# EAGLE design Eagle_TiltSwitch (EAGLE 7.2.0)
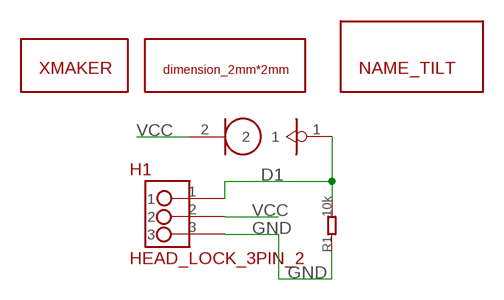
[diagram p0: schematic, sheet 1]

## Parts
H1  HEAD_LOCK_3PIN_2  [HEAD_LOCK_3PIN_2]
J1  TILT  [TILT]
R1  10k  005-R0603  [0603]
U$2  XMAKERLOGO  [XMAKERLOGO]
U$3  DIMENSION_2MM2MM  [DIMENSION_2MM*2MM]
U$4  NAME_LILT  [NAME_TILT]

## Nets
D1: H1.1 J1.1 R1.2
GND: H1.3 R1.1
VCC: H1.2 J1.2

## Library data of the parts
H1 = Xmaker:HEAD_LOCK_3PIN_2
J1 = Seeed:TILT
R1 = Discrete:005-R*
U$2 = Xmaker_yuhui:XMAKERLOGO
U$3 = Xmaker:DIMENSION_2MM*2MM
U$4 = Xmaker:NAME_LILT

## Board
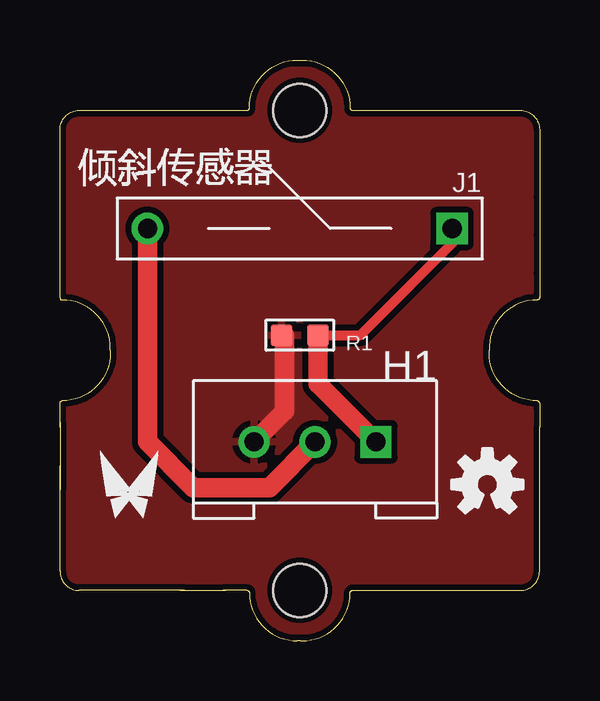
[diagram p1: board, top side]
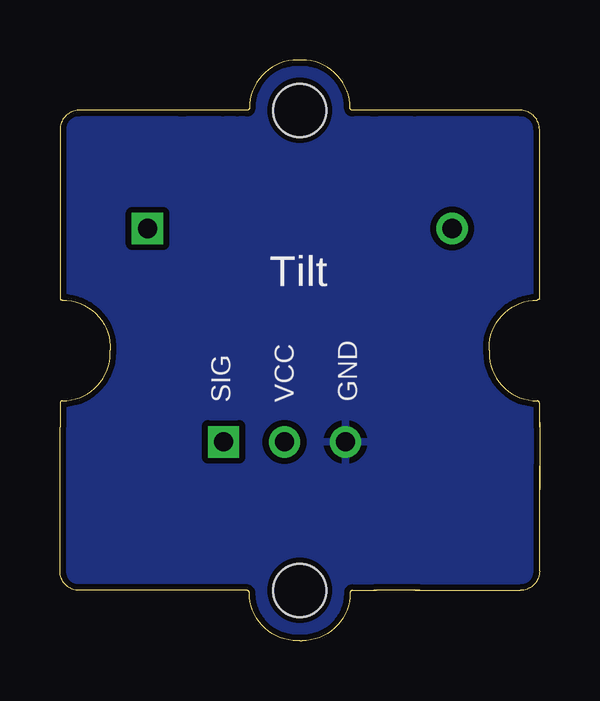
[diagram p2: board, bottom side, seen from below]

Size 20 x 24.2 mm. Coordinates in mm from the lower left corner, seen from the top.
Copper layers (1*16): Top 0.035mm / dielectric 1.5mm / Bottom 0.035mm
Design rules "SeeedStudio_rule_no_angle_090911": minimum track width 6mil, minimum drill 12mil, track to track 6mil, track to pad 6mil, pad to pad 6mil, via to via 6mil, smd to smd 0mil, copper to edge 10mil, drill to drill 10mil, minimum pad ring 10mil, minimum via ring 6mil, stop-mask expansion 2mil, vias tented up to drill 100mil, thermal gap 10mil

### Footprints (pad centres in the part's own frame; a part is rotated, then mirrored left to right if it is on the bottom)
HEAD_LOCK = drill 0.8 square: 1 0,0 | drill 0.8: 2 2.54,0; 3 5.08,0
TILT = drill 0.8 square: 1 0,0 | drill 0.8: 2 0,-12.7
0603 = smd 0.889 x 0.889: 1 -0.762,0; 2 0.762,0
U1N = hole 2.2: 0,-10; 0,10

### Placement (x,y rotation side)
H1  HEAD_LOCK  [HEAD_LOCK]  13.18,8.29 180 top
J1  16.35,17.18 270 top
R1  10,12.74 0 top
TWIG2  U1N  [U1N]  10,12.1 0 top
U$1  [OSHW-LOGO-S]  17.82,6.51 0 top
U$2  0.98,4.61 0 top

### Tracks (layer width: path | path; a pad name or v marks a point on that pad's centre or on a via)
D1
  Top 0.406: J1.1 16.35,16.55 12.54,12.74 R1.2 10.64,12.61
  Top 0.813: H1.1 10.76,10.7 R1.2
GND
  Top 0.813: R1.1 9.37,12.74 9.37,9.56 H1.3
  pour Top (isolate 0.254): -0.29,25.18 20.29,25.18 20.29,-0.98 -0.29,-0.98
  pour Bottom (isolate 0.254): -0.29,25.18 20.29,25.18 20.54,-0.98 -0.03,-0.98
VCC
  Top 0.813: H1.2 8.73,6.38 5.56,6.38 3.65,8.29 J1.2

### Text on the board
bPlace: Tilt | GND | VCC | SIG